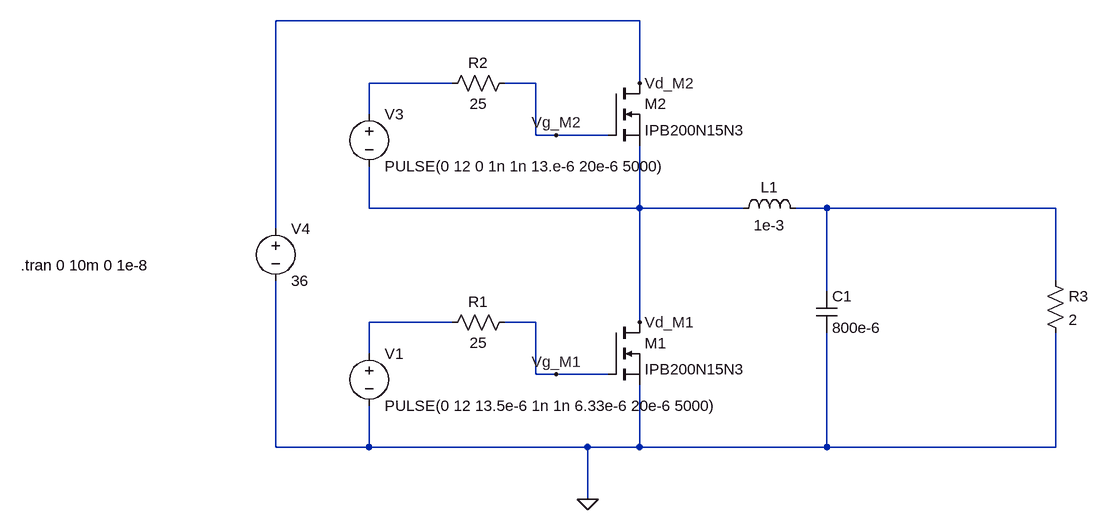
[diagram p0: schematic MOSFET.asc]
MOSFET.asc, the LTspice schematic file:
Version 4
SHEET 1 1144 680
WIRE 448 -384 -112 -384
WIRE 160 -288 32 -288
WIRE 288 -288 240 -288
WIRE 448 -288 448 -384
WIRE 32 -240 32 -288
WIRE 288 -208 288 -288
WIRE 320 -208 288 -208
WIRE 400 -208 320 -208
WIRE 32 -96 32 -160
WIRE 448 -96 448 -192
WIRE 448 -96 32 -96
WIRE 608 -96 448 -96
WIRE 736 -96 688 -96
WIRE 1088 -96 736 -96
WIRE -112 -64 -112 -384
WIRE 1088 16 1088 -96
WIRE 736 32 736 -96
WIRE 160 80 32 80
WIRE 288 80 240 80
WIRE 448 80 448 -96
WIRE 32 128 32 80
WIRE 288 160 288 80
WIRE 320 160 288 160
WIRE 400 160 320 160
WIRE -112 272 -112 16
WIRE 32 272 32 208
WIRE 32 272 -112 272
WIRE 368 272 32 272
WIRE 448 272 448 176
WIRE 448 272 368 272
WIRE 736 272 736 96
WIRE 736 272 448 272
WIRE 1088 272 1088 96
WIRE 1088 272 736 272
WIRE 368 352 368 272
FLAG 368 352 0
FLAG 448 80 Vd_M1
FLAG 320 160 Vg_M1
FLAG 448 -288 Vd_M2
FLAG 320 -208 Vg_M2
SYMBOL voltage 32 112 R0
WINDOW 123 0 0 Left 0
WINDOW 39 0 0 Left 0
SYMATTR InstName V1
SYMATTR Value PULSE(0 12 13.5e-6 1n 1n 6.33e-6 20e-6 5000)
SYMBOL nmos 400 80 R0
SYMATTR InstName M1
SYMATTR Value IPB200N15N3
SYMBOL res 256 64 R90
WINDOW 0 0 56 VBottom 2
WINDOW 3 32 56 VTop 2
SYMATTR InstName R1
SYMATTR Value 25
SYMBOL voltage 32 -256 R0
WINDOW 123 0 0 Left 0
WINDOW 39 0 0 Left 0
SYMATTR InstName V3
SYMATTR Value PULSE(0 12 0 1n 1n 13.e-6 20e-6 5000)
SYMBOL nmos 400 -288 R0
SYMATTR InstName M2
SYMATTR Value IPB200N15N3
SYMBOL res 256 -304 R90
WINDOW 0 0 56 VBottom 2
WINDOW 3 32 56 VTop 2
SYMATTR InstName R2
SYMATTR Value 25
SYMBOL voltage -112 -80 R0
WINDOW 123 0 0 Left 0
WINDOW 39 0 0 Left 0
SYMATTR InstName V4
SYMATTR Value 36
SYMBOL cap 720 32 R0
SYMATTR InstName C1
SYMATTR Value 800e-6
SYMBOL ind 592 -80 R270
WINDOW 0 32 56 VTop 2
WINDOW 3 5 56 VBottom 2
SYMATTR InstName L1
SYMATTR Value 1e-3
SYMBOL res 1072 0 R0
SYMATTR InstName R3
SYMATTR Value 2
TEXT -504 -8 Left 2 !.tran 0 10m 0 1e-8

The netlist it stands for:
* MOSFET.asc
V1 N003 0 PULSE(0 12 13.5e-6 1n 1n 6.33e-6 20e-6 5000)
M1 Vd_M1 Vg_M1 0 0 IPB200N15N3
R1 Vg_M1 N003 25
V3 N001 Vd_M1 PULSE(0 12 0 1n 1n 13.e-6 20e-6 5000)
M2 Vd_M2 Vg_M2 Vd_M1 Vd_M1 IPB200N15N3
R2 Vg_M2 N001 25
V4 Vd_M2 0 36
C1 N002 0 800e-6
L1 Vd_M1 N002 1e-3
R3 N002 0 2
.model NMOS NMOS
.model PMOS PMOS
.lib standard.mos
.tran 0 10m 0 1e-8
.backanno
.end